# EasyEDA Pro project little_squeaky_machine_v2_2026-02-17.epro, board Little Squeaky Machine
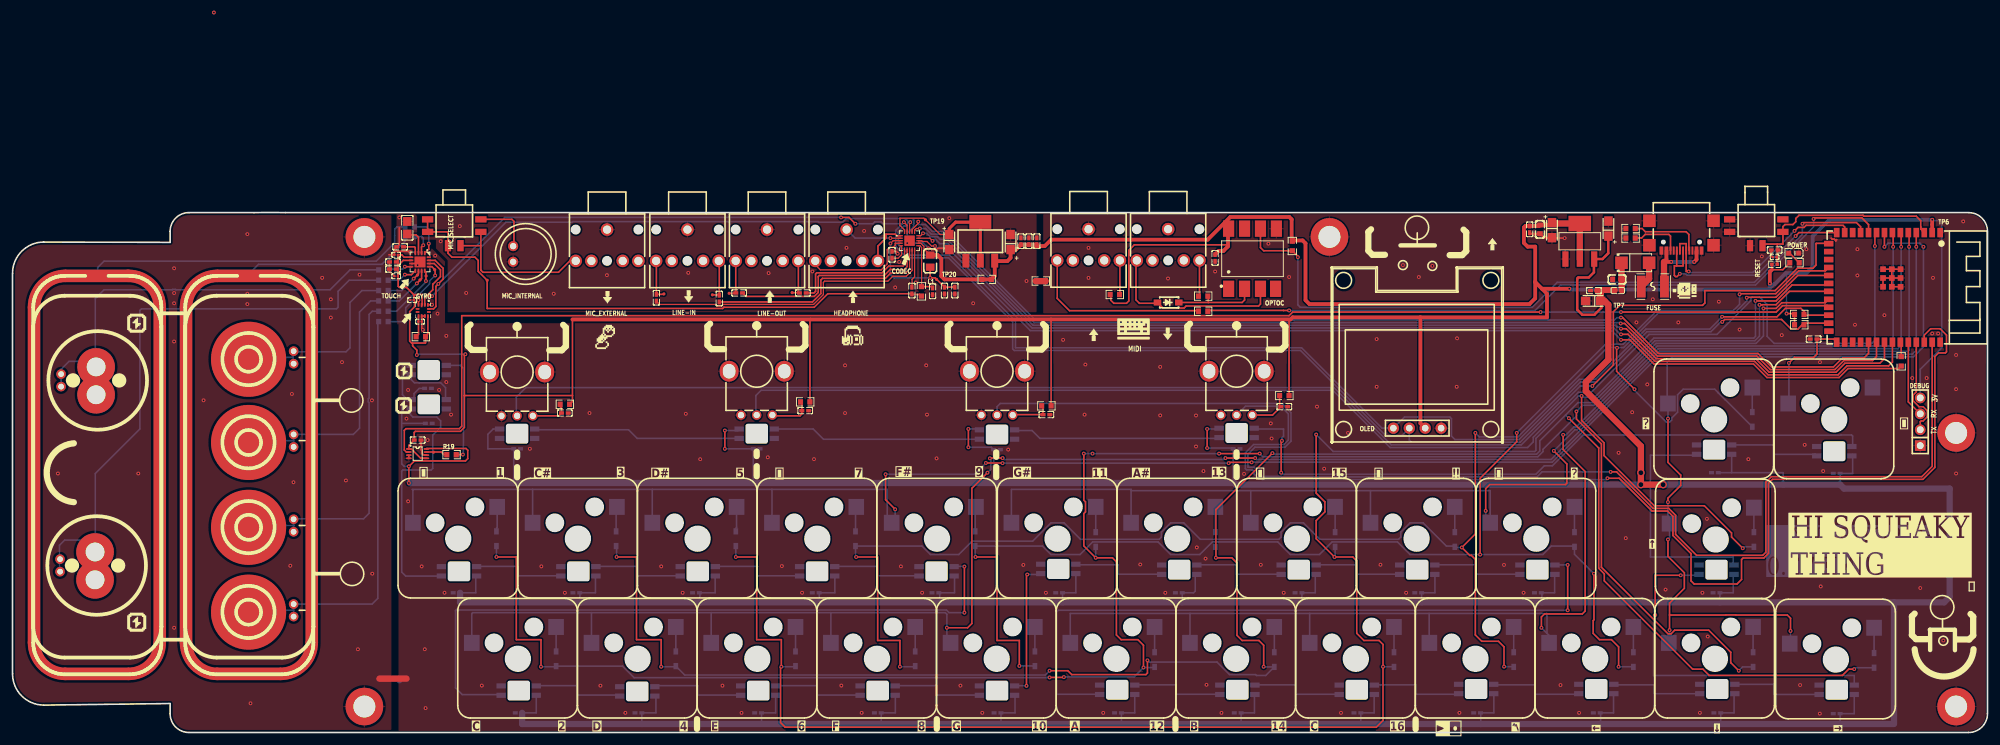
[diagram p8: board, top side]
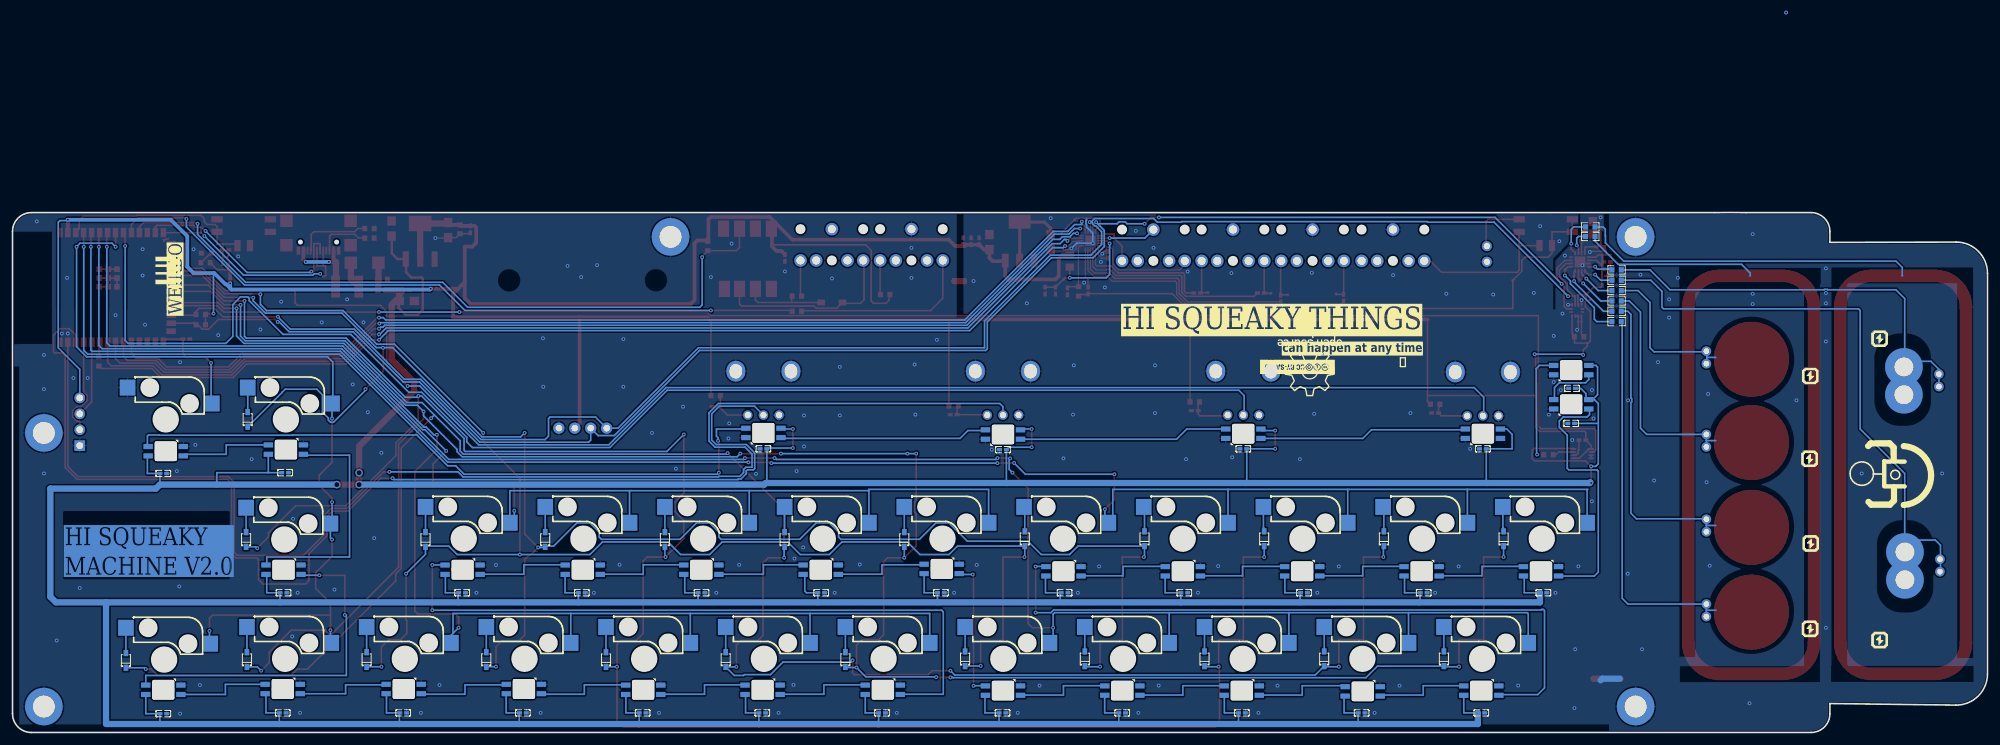
[diagram p9: board, bottom side, seen from below]

Outline 315.15 x 83.04 mm; copper layers: Top Layer, Bottom Layer. Coordinates in mm from the lower left corner of the outline.
Outline path: 0,73.32 arc(1.46,76.85) 5,78.32 25.15,78.26 25.15,80.02 arc(26.02,82.14) 28.15,83.02 38.53,83.02 arc(41.05,83.04) 43.57,83.02 312.15,83.02 arc(314.27,82.14) 315.15,80.02 315.15,3 arc(314.27,0.88) 312.15,0 28.15,0 arc(26.02,0.88) 25.15,3 25.15,4.62 5,4.37 arc(1.46,5.83) 0,9.37 0,73.32
Stack: Top Layer 0.035mm / Dielectric1 1.51mm FR4 er 4.5 / Bottom Layer 0.035mm

## Design rules (mm)
template: JLCPCB Capability(Two Layers Board)
spacing copperThickness1oz (default): track to track 0.102, other pairs 0.152 to 0.3
spacing copperThickness2oz: track to track 0.203, other pairs 0.152 to 0.3
track width copperThickness1oz (default): min 0.127, default 0.254, max 2.54
track width copperThickness2oz: min 0.203, default 0.254, max 2.54
differential pair differentialPair (default): width min 0.127, default 0.254, max 2.54; gap min 0.152, default 0.152
via viaSize (default): diameter min 0.5, default 0.61, max 10; hole min 0.3, default 0.305, max 6.3

## Placement (name value [footprint] x y rotation side)
3_3_BRIGDE  0  [R0603]  155.45 72.35 0 top
A_D_BRIDGE  0  [R0603]  164.08 72.09 0 top
C7  10uF  [C0603]  243.74 80.35 270 top
C8  100nF  [C0402]  242.09 80.35 90 top
C9  1uF  [C0201]  281.18 75.9 180 top
C10  100nF  [C0402]  287.4 62.82 0 top
C11  100nF  [C0402]  281.18 77.05 0 top
C12  10uF  [CASE-A_3216]  254.66 80.47 90 top
C13  22uF  [CASE-A_3216]  245.65 80.22 270 top
C14  10uF  [CASE-A_3216]  159.26 78.32 90 top
C15  22uF  [CASE-A_3216]  149.48 78.32 270 top
C16  100nF  [C0402]  64.64 46.69 180 top
C17  100nF  [C0402]  150.37 70.57 90 top
C18  2.2uF  [C0402]  148.72 70.57 90 top
C19  2.2uF  [C0402]  163.45 78.44 270 top
C20  100nF  [C0402]  160.91 78.45 270 top
C21  100nF  [C0402]  162.18 78.45 270 top
C22  150nF  [C0402]  140.34 76.29 270 top
C25  2.2uF  [C0402]  102.74 69.43 270 top
C26  2.2uF  [C0402]  112.78 69.3 270 top
C27  2.2uF  [C0402]  115.95 70.19 0 top
C28  2.2uF  [C0402]  126.11 70.19 0 top
C29  100nF  [C0402]  143.51 70.57 90 top
C30  2.2uF  [C0402]  146.81 70.45 90 top
C31  22uF  [C0402]  202.95 52.03 180 top
C32  22uF  [C0402]  164.97 50.76 180 top
C33  22uF  [C0402]  126.49 51.4 180 top
C34  22uF  [C0402]  88.14 51.01 180 top
C35  1uF  [C0201]  65.02 65.62 0 top
C36  1uF  [C0201]  63.75 69.05 180 top
C37  1uF  [C0201]  61.21 72.86 180 top
C38  100nF  [C0402]  60.71 74 0 top
C39  100nF  [C0402]  60.71 75.14 0 top
C40  1uF  [C0201]  61.21 76.28 180 top
C41  100nF  [C0402]  61.85 77.55 180 top
C43  2.2nF  [C0805]  62.99 80.6 90 top
C44  10uF  [CASE-A_3216]  252.22 68.92 180 top
C45  100nF  [C0402]  252.35 70.57 0 top
C46  10nF  [C0603]  256.03 72.35 0 top
CLED1  100nF  [C0402]  70.87 22.31 0 bottom
CLED2  100nF  [C0402]  89.97 22.31 0 bottom
CLED3  100nF  [C0402]  109.07 22.31 0 bottom
CLED4  100nF  [C0402]  128.17 22.31 0 bottom
CLED5  100nF  [C0402]  147.27 22.31 0 bottom
CLED6  100nF  [C0402]  80.77 3.13 0 bottom
CLED7  100nF  [C0402]  99.87 3.13 0 bottom
CLED8  100nF  [C0402]  118.97 3.13 0 bottom
CLED9  100nF  [C0402]  138.07 3.13 0 bottom
CLED10  100nF  [C0402]  157.17 3.13 0 bottom
CLED11  100nF  [C0402]  167 22.31 0 bottom
CLED12  100nF  [C0402]  186.1 22.31 0 bottom
CLED13  100nF  [C0402]  205.21 22.31 0 bottom
CLED14  100nF  [C0402]  224.31 22.31 0 bottom
CLED15  100nF  [C0402]  243.41 22.31 0 bottom
CLED16  100nF  [C0402]  176.4 3.13 0 bottom
CLED17  100nF  [C0402]  195.5 3.13 0 bottom
CLED18  100nF  [C0402]  214.6 3.13 0 bottom
CLED19  100nF  [C0402]  233.7 3.13 0 bottom
CLED20  100nF  [C0402]  252.8 3.13 0 bottom
CLED21  100nF  [C0402]  272.03 3.13 0 bottom
CLED22  100nF  [C0402]  291.08 3.01 0 bottom
CLED23  100nF  [C0402]  271.91 22.31 0 bottom
CLED24  100nF  [C0402]  271.65 41.49 0 bottom
CLED25  100nF  [C0402]  291.08 41.36 0 bottom
CLED26  100nF  [C0402]  195.33 45.3 180 bottom
CLED27  100nF  [C0402]  157.1 45.17 180 bottom
CLED28  100nF  [C0402]  118.75 45.3 180 bottom
CLED29  100nF  [C0402]  80.52 45.3 180 bottom
CLED30  100nF  [C0402]  66.42 49.36 180 bottom
CLED31  100nF  [C0402]  66.29 54.95 180 bottom
CMIDI  100nF  [C0402]  191.9 75.78 90 top
CODEC  SGTL5000XNLA3R2  [QFN-20_L3.0-W3.0-P0.40-BL-EP1.7]  143.14 78.53 270 top
D1  SS34  [SMA_L4.3-W2.6-LS5.2-RD]  258.95 75.01 0 top
D2  1N914W  [SOD-123_L2.7-W1.6-LS3.7-RD-1]  184.4 68.67 180 top
DEBUG  B-2100S04P-C000  [HDR-TH_4P-P2.54-V-M]  304.42 49.61 90 top
ESP32S3  ESP32-S3-WROOM-1-N16R8  [WIRELM-SMD_ESP32-S3-WROOM-1]  298.7 71.08 270 top
FUSE  SMD1812-300C-16V  [F1812]  261.75 71.2 180 top
GYRO  STK8321  [LGA-12_L2.0-W2.0-P0.50-TR]  65.53 67.39 0 top
HEADPHONE  PJ-3062-HD-B  [AUDIO-TH_PJ-3062-HD-B]  133.1 77.81 270 top
KEY_1  CPG151101S11-16  [SMD_KEYBOARD-SW]  70.61 34.76 0 bottom
KEY_2  CPG151101S11-16  [SMD_KEYBOARD-SW]  89.71 34.76 0 bottom
KEY_3  CPG151101S11-16  [SMD_KEYBOARD-SW]  108.81 34.76 0 bottom
KEY_4  CPG151101S11-16  [SMD_KEYBOARD-SW]  127.91 34.76 0 bottom
KEY_5  CPG151101S11-16  [SMD_KEYBOARD-SW]  147.01 34.76 0 bottom
KEY_6  CPG151101S11-16  [SMD_KEYBOARD-SW]  80.01 15.58 0 bottom
KEY_7  CPG151101S11-16  [SMD_KEYBOARD-SW]  99.11 15.58 0 bottom
KEY_8  CPG151101S11-16  [SMD_KEYBOARD-SW]  118.21 15.58 0 bottom
KEY_9  CPG151101S11-16  [SMD_KEYBOARD-SW]  137.31 15.58 0 bottom
KEY_10  CPG151101S11-16  [SMD_KEYBOARD-SW]  156.41 15.58 0 bottom
KEY_11  CPG151101S11-16  [SMD_KEYBOARD-SW]  166.12 34.76 0 bottom
KEY_12  CPG151101S11-16  [SMD_KEYBOARD-SW]  185.22 34.76 0 bottom
KEY_13  CPG151101S11-16  [SMD_KEYBOARD-SW]  204.32 34.76 0 bottom
KEY_14  CPG151101S11-16  [SMD_KEYBOARD-SW]  223.42 34.76 0 bottom
KEY_15  CPG151101S11-16  [SMD_KEYBOARD-SW]  242.52 34.76 0 bottom
KEY_16  CPG151101S11-16  [SMD_KEYBOARD-SW]  175.51 15.58 0 bottom
KEY_17  CPG151101S11-16  [SMD_KEYBOARD-SW]  194.61 15.58 0 bottom
KEY_18  CPG151101S11-16  [SMD_KEYBOARD-SW]  213.71 15.58 0 bottom
KEY_19  CPG151101S11-16  [SMD_KEYBOARD-SW]  232.81 15.58 0 bottom
KEY_20  CPG151101S11-16  [SMD_KEYBOARD-SW]  251.91 15.58 0 bottom
KEY_21  CPG151101S11-16  [SMD_KEYBOARD-SW]  271.02 15.58 0 bottom
KEY_22  CPG151101S11-16  [SMD_KEYBOARD-SW]  290.32 15.45 0 bottom
KEY_23  CPG151101S11-16  [SMD_KEYBOARD-SW]  271.14 34.63 0 bottom
KEY_24  CPG151101S11-16  [SMD_KEYBOARD-SW]  270.89 53.81 0 bottom
KEY_25  CPG151101S11-16  [SMD_KEYBOARD-SW]  290.07 53.81 0 bottom
KEY_D1  -  [SOD-323_L1.8-W1.3-LS2.5-RD]  77.22 30.95 90 bottom
KEY_D2  -  [SOD-323_L1.8-W1.3-LS2.5-RD]  96.32 30.95 90 bottom
KEY_D3  -  [SOD-323_L1.8-W1.3-LS2.5-RD]  115.42 30.95 90 bottom
KEY_D4  -  [SOD-323_L1.8-W1.3-LS2.5-RD]  134.52 30.95 90 bottom
KEY_D5  -  [SOD-323_L1.8-W1.3-LS2.5-RD]  153.62 30.95 90 bottom
KEY_D6  -  [SOD-323_L1.8-W1.3-LS2.5-RD]  86.74 11.77 90 bottom
KEY_D7  -  [SOD-323_L1.8-W1.3-LS2.5-RD]  105.84 11.77 90 bottom
KEY_D8  -  [SOD-323_L1.8-W1.3-LS2.5-RD]  124.94 11.77 90 bottom
KEY_D9  -  [SOD-323_L1.8-W1.3-LS2.5-RD]  144.04 11.77 90 bottom
KEY_D10  -  [SOD-323_L1.8-W1.3-LS2.5-RD]  163.14 11.77 90 bottom
KEY_D11  -  [SOD-323_L1.8-W1.3-LS2.5-RD]  172.85 30.82 90 bottom
KEY_D12  -  [SOD-323_L1.8-W1.3-LS2.5-RD]  191.95 30.82 90 bottom
KEY_D13  -  [SOD-323_L1.8-W1.3-LS2.5-RD]  211.05 30.82 90 bottom
KEY_D14  -  [SOD-323_L1.8-W1.3-LS2.5-RD]  230.15 30.82 90 bottom
KEY_D15  -  [SOD-323_L1.8-W1.3-LS2.5-RD]  249.25 30.82 90 bottom
KEY_D16  -  [SOD-323_L1.8-W1.3-LS2.5-RD]  182.25 11.64 90 bottom
KEY_D17  -  [SOD-323_L1.8-W1.3-LS2.5-RD]  201.34 11.64 90 bottom
KEY_D18  -  [SOD-323_L1.8-W1.3-LS2.5-RD]  220.44 11.64 90 bottom
KEY_D19  -  [SOD-323_L1.8-W1.3-LS2.5-RD]  239.55 11.64 90 bottom
KEY_D20  -  [SOD-323_L1.8-W1.3-LS2.5-RD]  258.64 11.64 90 bottom
KEY_D21  -  [SOD-323_L1.8-W1.3-LS2.5-RD]  277.75 11.64 90 bottom
KEY_D22  -  [SOD-323_L1.8-W1.3-LS2.5-RD]  297.05 11.51 90 bottom
KEY_D23  -  [SOD-323_L1.8-W1.3-LS2.5-RD]  277.88 30.82 90 bottom
KEY_D24  -  [SOD-323_L1.8-W1.3-LS2.5-RD]  277.62 50 90 bottom
KEY_SW_1  CPG1511F01S04  [KEY-TH_CPG1511F01S0X]  70.48 34.76 0 top
KEY_SW_2  CPG1511F01S04  [KEY-TH_CPG1511F01S0X]  89.59 34.76 0 top
KEY_SW_3  CPG1511F01S04  [KEY-TH_CPG1511F01S0X]  108.69 34.76 0 top
KEY_SW_4  CPG1511F01S04  [KEY-TH_CPG1511F01S0X]  127.78 34.76 0 top
KEY_SW_5  CPG1511F01S04  [KEY-TH_CPG1511F01S0X]  146.88 34.76 0 top
KEY_SW_6  CPG1511F01S04  [KEY-TH_CPG1511F01S0X]  80.01 15.58 0 top
KEY_SW_7  CPG1511F01S04  [KEY-TH_CPG1511F01S0X]  99.11 15.58 0 top
KEY_SW_8  CPG1511F01S04  [KEY-TH_CPG1511F01S0X]  118.21 15.58 0 top
KEY_SW_9  CPG1511F01S04  [KEY-TH_CPG1511F01S0X]  137.31 15.58 0 top
KEY_SW_10  CPG1511F01S04  [KEY-TH_CPG1511F01S0X]  156.41 15.58 0 top
KEY_SW_11  CPG1511F01S04  [KEY-TH_CPG1511F01S0X]  166.12 34.76 0 top
KEY_SW_12  CPG1511F01S04  [KEY-TH_CPG1511F01S0X]  185.22 34.76 0 top
KEY_SW_13  CPG1511F01S04  [KEY-TH_CPG1511F01S0X]  204.32 34.76 0 top
KEY_SW_14  CPG1511F01S04  [KEY-TH_CPG1511F01S0X]  223.42 34.76 0 top
KEY_SW_15  CPG1511F01S04  [KEY-TH_CPG1511F01S0X]  242.52 34.76 0 top
KEY_SW_16  CPG1511F01S04  [KEY-TH_CPG1511F01S0X]  175.51 15.58 0 top
KEY_SW_17  CPG1511F01S04  [KEY-TH_CPG1511F01S0X]  194.61 15.58 0 top
KEY_SW_18  CPG1511F01S04  [KEY-TH_CPG1511F01S0X]  213.71 15.58 0 top
KEY_SW_19  CPG1511F01S04  [KEY-TH_CPG1511F01S0X]  232.81 15.58 0 top
KEY_SW_20  CPG1511F01S04  [KEY-TH_CPG1511F01S0X]  251.91 15.58 0 top
KEY_SW_21  CPG1511F01S04  [KEY-TH_CPG1511F01S0X]  271.02 15.58 0 top
KEY_SW_22  CPG1511F01S04  [KEY-TH_CPG1511F01S0X]  290.32 15.45 0 top
KEY_SW_23  CPG1511F01S04  [KEY-TH_CPG1511F01S0X]  271.14 34.63 0 top
KEY_SW_24  CPG1511F01S04  [KEY-TH_CPG1511F01S0X]  270.89 53.81 0 top
KEY_SW_25  CPG1511F01S04  [KEY-TH_CPG1511F01S0X]  290.07 53.81 0 top
L1  HCB2012KV-601T20  [L0805]  146.43 75.27 270 top
L2  BLM15PX330SN1D  [L0402]  256.16 70.57 180 top
LDO  AMS1117-3.3  [SOT-223-4_L6.5-W3.5-P2.30-LS7.0-BR]  250.09 78.44 270 top
LED1  SK6812MINI-E  [LED-SMD_L3.2-W2.8-LS5.9_SK6812MINI-E]  71.25 25.74 0 bottom
LED2  SK6812MINI-E  [LED-SMD_L3.2-W2.8-LS5.9_SK6812MINI-E]  90.3 25.74 0 bottom
LED3  SK6812MINI-E  [LED-SMD_L3.2-W2.8-LS5.9_SK6812MINI-E]  109.35 25.74 0 bottom
LED4  SK6812MINI-E  [LED-SMD_L3.2-W2.8-LS5.9_SK6812MINI-E]  128.4 25.74 0 bottom
LED5  SK6812MINI-E  [LED-SMD_L3.2-W2.8-LS5.9_SK6812MINI-E]  147.45 25.74 0 bottom
LED6  SK6812MINI-E  [LED-SMD_L3.2-W2.8-LS5.9_SK6812MINI-E]  80.77 6.69 0 bottom
LED7  SK6812MINI-E  [LED-SMD_L3.2-W2.8-LS5.9_SK6812MINI-E]  99.7 6.56 0 bottom
LED8  SK6812MINI-E  [LED-SMD_L3.2-W2.8-LS5.9_SK6812MINI-E]  119 6.69 0 bottom
LED9  SK6812MINI-E  [LED-SMD_L3.2-W2.8-LS5.9_SK6812MINI-E]  138.05 6.69 0 bottom
LED10  SK6812MINI-E  [LED-SMD_L3.2-W2.8-LS5.9_SK6812MINI-E]  157.1 6.69 0 bottom
LED11  SK6812MINI-E  [LED-SMD_L3.2-W2.8-LS5.9_SK6812MINI-E]  166.88 26.12 0 bottom
LED12  SK6812MINI-E  [LED-SMD_L3.2-W2.8-LS5.9_SK6812MINI-E]  186.18 25.99 0 bottom
LED13  SK6812MINI-E  [LED-SMD_L3.2-W2.8-LS5.9_SK6812MINI-E]  205.23 25.99 0 bottom
LED14  SK6812MINI-E  [LED-SMD_L3.2-W2.8-LS5.9_SK6812MINI-E]  224.16 25.99 0 bottom
LED15  SK6812MINI-E  [LED-SMD_L3.2-W2.8-LS5.9_SK6812MINI-E]  243.33 25.99 0 bottom
LED16  SK6812MINI-E  [LED-SMD_L3.2-W2.8-LS5.9_SK6812MINI-E]  176.28 6.82 0 bottom
LED17  SK6812MINI-E  [LED-SMD_L3.2-W2.8-LS5.9_SK6812MINI-E]  195.45 6.82 0 bottom
LED18  SK6812MINI-E  [LED-SMD_L3.2-W2.8-LS5.9_SK6812MINI-E]  214.5 6.82 0 bottom
LED19  SK6812MINI-E  [LED-SMD_L3.2-W2.8-LS5.9_SK6812MINI-E]  233.55 6.94 0 bottom
LED20  SK6812MINI-E  [LED-SMD_L3.2-W2.8-LS5.9_SK6812MINI-E]  252.73 6.94 0 bottom
LED21  SK6812MINI-E  [LED-SMD_L3.2-W2.8-LS5.9_SK6812MINI-E]  272.03 6.94 0 bottom
LED22  SK6812MINI-E  [LED-SMD_L3.2-W2.8-LS5.9_SK6812MINI-E]  291.08 6.82 0 bottom
LED23  SK6812MINI-E  [LED-SMD_L3.2-W2.8-LS5.9_SK6812MINI-E]  271.91 25.99 0 bottom
LED24  SK6812MINI-E  [LED-SMD_L3.2-W2.8-LS5.9_SK6812MINI-E]  271.53 45.17 0 bottom
LED25  SK6812MINI-E  [LED-SMD_L3.2-W2.8-LS5.9_SK6812MINI-E]  290.7 44.92 0 bottom
LED26  SK6812MINI-E  [LED-SMD_L3.2-W2.8-LS5.9_SK6812MINI-E]  195.33 47.84 180 bottom
LED27  SK6812MINI-E  [LED-SMD_L3.2-W2.8-LS5.9_SK6812MINI-E]  157.1 47.58 180 bottom
LED28  SK6812MINI-E  [LED-SMD_L3.2-W2.8-LS5.9_SK6812MINI-E]  118.75 47.71 180 bottom
LED29  SK6812MINI-E  [LED-SMD_L3.2-W2.8-LS5.9_SK6812MINI-E]  80.52 47.71 180 bottom
LED30  SK6812MINI-E  [LED-SMD_L3.2-W2.8-LS5.9_SK6812MINI-E]  66.42 57.87 180 bottom
LED31  SK6812MINI-E  [LED-SMD_L3.2-W2.8-LS5.9_SK6812MINI-E]  66.42 52.41 180 bottom
LINE-IN  PJ-3062-HD-B  [AUDIO-TH_PJ-3062-HD-B]  107.7 77.81 270 top
LINE-OUT  PJ-3062-HD-B  [AUDIO-TH_PJ-3062-HD-B]  120.4 77.81 270 top
MIC_EXTERNAL  PJ-3062-HD-B  [AUDIO-TH_PJ-3062-HD-B]  94.87 77.81 270 top
MIC_INTERNAL  KEAG4544PF-K  [MIC-TH_BD9.7-P2.50-D0.8-L-FD]  79.88 76.41 270 top
MIC_SELECT  XKB5858-Z-F-75  [SW-SMD_XKB5858-Z-F-75]  70.48 79.84 0 top
MIDI-IN  PJ-3062-HD-B  [AUDIO-TH_PJ-3062-HD-B]  184.4 77.88 270 top
MIDI-OUT  PJ-3062-HD-B  [AUDIO-TH_PJ-3062-HD-B]  171.7 77.88 270 top
NOREF  -  [Pad_e110]  310.15 47.84 0 top
NOREF#2  -  [Pad_e1855]  56.15 4.14 0 top
NOREF#3  -  [Pad_e3607]  210.15 79.14 0 top
NOREF#4  -  [Pad_e1861]  310.15 4.14 0 top
NOREF#5  -  [Pad_e3629]  56.15 79.14 0 top
OLED  HS96L03W2C03  [OLED-TH_L27.8-W27.2-P2.54_C9900033791]  224.16 48.6 180 top
OPTOC  6N137S1(TA)  [SMD-8_L9.8-W6.6-P2.54-LS10.3-BL]  197.87 75.65 0 top
POT_1  10kΩ  [RES-ADJ-TH_RK09K1130A5R]  80.52 54.06 0 top
POT_2  10kΩ  [RES-ADJ-TH_RK09K1130A5R]  118.75 54.19 0 top
POT_3  10kΩ  [RES-ADJ-TH_RK09K1130A5R]  157.1 54.19 0 top
POT_4  10kΩ  [RES-ADJ-TH_RK09K1130A5R]  195.33 54.19 0 top
POWER  F.0603.00025/P2-0603G1TS2-06T-002  [LED0603-RD_GREEN]  284.23 76.54 180 top
R1  5.1kΩ  [R0603]  258.19 78.95 0 top
R2  5.1kΩ  [R0603]  258.19 80.48 0 top
R3  10kΩ  [R0402]  281.18 74.76 0 top
R4  1kΩ  [R0603]  284.35 75.01 0 top
R5  2.2kΩ  [R0603]  285.11 65.11 0 top
R6  2.2kΩ  [R0603]  285.11 66.76 0 top
R7  100Ω  [R0603]  301.37 59.27 270 top
R8  2.2kΩ  [R0603]  145.03 70.45 90 top
R9  220Ω  [R0603]  189.99 69.68 0 top
R10  470Ω  [R0603]  204.22 77.68 90 top
R12  33Ω  [R0603]  175.9 69.93 180 top
R13  10Ω  [R0603]  189.99 67.27 0 top
R14  100Ω  [R0603]  202.95 53.81 0 top
R15  100Ω  [R0603]  164.97 52.16 0 top
R16  100Ω  [R0603]  126.49 52.79 0 top
R17  100Ω  [R0603]  88.14 52.41 0 top
R18  22Ω  [R0603]  65.15 63.2 0 top
R19  500Ω  [R0603]  70.05 44.36 0 top
R20  500Ω  [R0603]  59.18 70.57 180 bottom
R21  500Ω  [R0603]  59.18 67.27 180 bottom
R22  500Ω  [R0603]  59.18 65.62 180 bottom
R23  500Ω  [R0603]  59.18 68.92 180 bottom
R24  500Ω  [R0603]  59.18 73.87 0 bottom
R25  500Ω  [R0603]  59.18 72.22 0 bottom
R26  500Ω  [R0603]  63.37 80.73 0 bottom
R27  500Ω  [R0603]  63.37 79.21 0 bottom
RESET  XKB5858-W-F-75  [SW-SMD_XKB5858-W-F-75]  278.26 79.84 0 top
TOUCH  CY8CMBR3108-LQXI  [QFN-16_L3.0-W3.0-P0.50-BL-EP1.7]  65.02 75.14 180 top
TP2  -  [matrix_touchpad]  37.46 33.06 0 top
TP3  -  [matrix_touchpad]  37.47 19.52 0 top
TP4  -  [matrix_touchpad]  37.47 59.9 0 top
TP5  -  [matrix_touchpad]  37.46 46.61 0 top
TP6  -  [Test-Point-0.5mm]  306.32 81.11 0 top
TP7  -  [Test-Point-0.5mm]  254.63 67.52 0 top
TP14  -  [Test-Point-0.5mm]  75.74 72.21 0 top
TP15  -  [Test-Point-0.5mm]  103.94 70.03 0 top
TP16  -  [Test-Point-0.5mm]  111.69 69.89 0 top
TP17  -  [Test-Point-0.5mm]  114.35 70.13 0 top
TP18  -  [Test-Point-0.5mm]  124.4 70.24 0 top
TP19  -  [Test-Point-0.5mm]  145.67 81.87 0 top
TP20  -  [Test-Point-0.5mm]  147.45 72.35 0 top
TP21  -  [Test-Point-0.5mm]  67.17 44.77 0 top
TP22  -  [Test-Point-0.5mm]  64.61 73.05 0 top
TP23  -  [Test-Point-0.5mm]  65.99 72.91 0 top
TP24  -  [Test-Point-0.5mm]  67.37 73.89 0 top
TP25  -  [Test-Point-0.5mm]  65.01 72.25 0 top
TPA1  -  [touchpad_external]  13.46 55.58 0 top
TPA2  -  [touchpad_external]  13.3 26.03 0 top
U1  AMS1117-1.8  [SOT-223_L6.7-W3.5-P2.30-BR]  154.43 78.45 270 top
U2  GT74LVC2T45V8  [VSSOP-8_L2.3-W2.0-P0.50-LS3.1-BL]  64.64 44.53 270 top
U5  -  [proximity_sensor]  2.29 73.87 0 top
U6  -  [proximity_sensor]  26.54 73.87 0 top
USB  TYPEC-304YSSW-ACP16  [USB-SMD_TYPEC-304YSSW-ACP16]  266.32 79.33 180 top

## Footprints (pads in the part's own frame, mm; a bottom-side part is the same pattern mirrored in y, then rotated)
AUDIO-TH_PJ-3062-HD-B
  round 2 hole 1.3: 1(-2.5,0) 2(2.5,5) 3(2.5,2.499) 4(2.5,-2.5) 5(2.5,-5)
C0201
  rect 0.368x0.324 smd: 1(-0.275,0) 2(0.275,0)
C0402
  rect 0.79x0.54 smd: 1(-0.545,0) 2(0.545,0)
C0603
  rect 0.8x0.9 smd: 1(-0.7,0) 2(0.7,0)
C0805
  rect 1.41x1.35 smd: 1(-1,0) 2(1,0)
CASE-A_3216
  rect 1.5x1.359 smd: 1(-1.2,0) 2(1.2,0)
F1812
  rect 1.407x3.499 smd: 1(-1.853,0) 2(1.853,0)
HDR-TH_4P-P2.54-V-M
  rect 1.7x1.7 hole 1.1: 1(-3.81,0)
  round 1.7 hole 1.1: 2(-1.27,0) 3(1.27,0) 4(3.81,0)
L0402
  rect 0.54x0.54 smd: 1(-0.42,0) 2(0.42,0)
L0805
  rect 1.133x1.377 smd: 1(-0.966,0) 2(0.966,0)
LED0603-RD_GREEN
  rect 0.8x0.8 smd: 1(-0.799,-0.004) 2(0.799,0.004)
LED-SMD_L3.2-W2.8-LS5.9_SK6812MINI-E
  rect 1.5x0.82 smd: 1(2.8,0.75) 2(2.8,-0.75) 3(-2.8,-0.75) 4(-2.8,0.75)
LGA-12_L2.0-W2.0-P0.50-TR
  rect 0.28x0.58 smd: 1(0.75,0.9) 2(0.25,0.9) 4(-0.75,0.9) 7(-0.75,-0.9) 8(-0.25,-0.9) 9(0.25,-0.9) 10(0.75,-0.9)
  rect 0.28x0.67 smd: 3(-0.25,0.855)
  rect 0.58x0.28 smd: 5(-0.9,0.25) 6(-0.9,-0.25) 11(0.9,-0.25) 12(0.9,0.25)
matrix_touchpad
  round 1.524 hole 0.914: 1(7.389,0.989) 1(7.389,-1.011)
MIC-TH_BD9.7-P2.50-D0.8-L-FD
  round 1.6 hole 1: 1(-1.25,0) 2(1.25,0)
OLED-TH_L27.8-W27.2-P2.54_C9900033791
  round 1.8 hole 1.05: 1(-3.81,0) 2(-1.27,0) 3(1.27,0) 4(3.81,0)
Pad_e110
  round 6 hole 3.5: (0,0)
Pad_e1855
  round 6 hole 3.5: (0,0)
Pad_e1861
  round 6 hole 3.5: (0,0)
Pad_e3607
  round 6 hole 3.5: (0,0)
Pad_e3629
  round 6 hole 3.5: (0,0)
QFN-16_L3.0-W3.0-P0.50-BL-EP1.7
  rect 0.28x0.665 smd: 1(-0.75,-1.407) 2(-0.25,-1.407) 3(0.25,-1.407) 4(0.75,-1.407) 9(0.75,1.407) 10(0.25,1.407) 11(-0.25,1.407) 12(-0.75,1.407)
  rect 0.665x0.28 smd: 5(1.407,-0.75) 6(1.407,-0.25) 7(1.407,0.25) 8(1.407,0.75) 13(-1.407,0.75) 14(-1.407,0.25) 15(-1.407,-0.25) 16(-1.407,-0.75)
  rect 1.75x1.75 smd: 17(0,0)
QFN-20_L3.0-W3.0-P0.40-BL-EP1.7
  rect 0.2x0.665 smd: 1(-0.8,-1.407) 2(-0.4,-1.407) 3(0,-1.407) 4(0.4,-1.407) 5(0.8,-1.407) 11(0.8,1.407) 12(0.4,1.407) 13(0,1.407) 14(-0.4,1.407) 15(-0.8,1.407)
  rect 0.665x0.2 smd: 6(1.407,-0.8) 7(1.407,-0.4) 8(1.407,0) 9(1.407,0.4) 10(1.407,0.8) 16(-1.407,0.8) 17(-1.407,0.4) 18(-1.407,0) 19(-1.407,-0.4) 20(-1.407,-0.8)
  rect 1.65x1.65 smd: 21(0,0)
R0402
  rect 0.566x0.54 smd: 1(-0.433,0) 2(0.433,0)
R0603
  rect 0.806x0.864 smd: 1(-0.753,0) 2(0.753,0)
RES-ADJ-TH_RK09K1130A5R
  round 1.5 hole 1: 1(-2.5,-3.5) 2(0,-3.5) 3(2.5,-3.5)
  oval 3x3.3 hole 2x2.3: 4(4.4,3.5) 5(-4.4,3.5)
SMA_L4.3-W2.6-LS5.2-RD
  rect 2x2 smd: 1(-2.2,0) 2(2.2,0)
SMD-8_L9.8-W6.6-P2.54-LS10.3-BL
  rect 1.78x2.6 smd: 1(-3.81,-4.8) 2(-1.27,-4.8) 3(1.27,-4.8) 4(3.683,-4.8) 5(3.81,4.8) 6(1.27,4.8) 7(-1.27,4.8) 8(-3.81,4.8)
SMD_KEYBOARD-SW
  rect 2.5x2.55 smd: 1(-6.725,1.27) 2(6.725,-1.27)
SOD-123_L2.7-W1.6-LS3.7-RD-1
  rect 1.2x0.95 smd: 1(-1.7,0) 2(1.7,0)
SOD-323_L1.8-W1.3-LS2.5-RD
  rect 1x0.75 smd: 1(-1.173,0) 2(1.173,0)
SOT-223-4_L6.5-W3.5-P2.30-LS7.0-BR
  rect 2.47x0.98 smd: 1(2.835,-2.3) 2(2.835,0) 3(2.835,2.3)
  rect 2.47x3.6 smd: 4(-2.835,0)
SOT-223_L6.7-W3.5-P2.30-BR
  rect 2.2x1.1 smd: 1(3.099,-2.3) 2(3.099,0) 3(3.099,2.3)
  rect 2.2x3.5 smd: 4(-3.099,0)
SW-SMD_XKB5858-W-F-75
  rect 1.8x1 smd: 1(-4.25,2.1) 2(-4.25,0.1) 3(4.25,2.1) 4(4.25,0.1)
  rect 1x1.8 smd: 5(-1,-2.1) 6(1,-2.1)
SW-SMD_XKB5858-Z-F-75
  rect 1.8x1 smd: 1(-4.25,2.1) 2(-4.25,0.1) 3(4.25,2.1) 4(4.25,0.1)
  rect 1x1.8 smd: 5(-1,-2.1) 6(1,-2.1)
Test-Point-0.5mm
  round 0.5 smd: 1(0,0)
touchpad_external
  round 1.524 hole 0.914: 1(-5.715,1.651) 1(-5.715,-0.349)
  round 6 hole 3: 1(-0.127,2.794) 1(-0.127,-1.651)
USB-SMD_TYPEC-304YSSW-ACP16
  rect 2x2 smd: 13(-5.12,1.52) 14(5.12,1.52) 15(-5.12,-2.38) 16(5.12,-2.38)
  rect 0.6x1.3 smd: A1B12(-3.2,2.38) A4B9(-2.4,2.38) B1A12(3.2,2.38) B4A9(2.4,2.38)
  rect 0.3x1.3 smd: A5(-1.25,2.38) A6(-0.25,2.38) A7(0.25,2.38) A8(1.25,2.38) B5(1.75,2.38) B6(0.75,2.38) B7(-0.75,2.38) B8(-1.75,2.38)
VSSOP-8_L2.3-W2.0-P0.50-LS3.1-BL
  oval 0.28x0.905 smd: 1(-0.75,-1.403) 2(-0.25,-1.403) 3(0.25,-1.403) 4(0.75,-1.403) 5(0.75,1.403) 6(0.25,1.403) 7(-0.25,1.403) 8(-0.75,1.403)
WIRELM-SMD_ESP32-S3-WROOM-1
  rect 1.5x0.9 smd: 1(-8.75,8.895) 2(-8.75,7.625) 3(-8.75,6.355) 4(-8.75,5.085) 5(-8.75,3.815) 6(-8.75,2.545) 7(-8.75,1.275) 8(-8.75,0.005) 9(-8.75,-1.265) 10(-8.75,-2.535) 11(-8.75,-3.805) 12(-8.75,-5.075) 13(-8.75,-6.345) 14(-8.75,-7.615) 27(8.75,-7.615) 28(8.75,-6.345) 29(8.75,-5.075) 30(8.75,-3.805) 31(8.75,-2.535) 32(8.75,-1.265) 33(8.75,0.005) 34(8.75,1.275) 35(8.75,2.545) 36(8.75,3.815) 37(8.75,5.085) 38(8.75,6.355) 39(8.75,7.625) 40(8.75,8.895)
  rect 0.9x1.5 smd: 15(-6.985,-8.895) 16(-5.715,-8.895) 17(-4.445,-8.895) 18(-3.175,-8.895) 19(-1.905,-8.895) 20(-0.635,-8.895) 21(0.635,-8.895) 22(1.905,-8.895) 23(3.175,-8.895) 24(4.445,-8.895) 25(5.715,-8.895) 26(6.985,-8.865)
  rect 0.9x0.9 smd: 41(-2.9,2.575) 41(-2.9,1.175) 41(-2.9,-0.225) 41(-1.5,2.575) 41(-1.5,1.175) 41(-1.5,-0.225) 41(-0.1,2.575) 41(-0.1,1.175) 41(-0.1,-0.225)

## Nets
As in the schematic, except:
AGND: A_D_BRIDGE.1 A_D_BRIDGE.2 C7.2 C8.1 C9.2 C10.1 C11.1 C12.2 C13.2 C14.2 C15.2 C16.1 C17.1 C18.1 C19.1 C20.1 C21.1 C22.1 C30.1 C31.1 C32.1 C33.1 C34.1 C35.2 C36.2 C37.2 C38.1 C39.1 C40.2 C41.2 C43.2 C44.2 C45.1 C46.1 CLED1.1 CLED2.1 CLED3.1 CLED4.1 CLED5.1 CLED6.1 CLED7.1 CLED8.1 CLED9.1 CLED10.1 CLED11.1 CLED12.1 CLED13.1 CLED14.1 CLED15.1 CLED16.1 CLED17.1 CLED18.1 CLED19.1 CLED20.1 CLED21.1 CLED22.1 CLED23.1 CLED24.1 CLED25.1 CLED26.1 CLED27.1 CLED28.1 CLED29.1 CLED30.1 CLED31.1 CMIDI.1 CODEC.21 DEBUG.1 ESP32S3.1 ESP32S3.40 ESP32S3.41 GYRO.1 GYRO.4 GYRO.8 GYRO.9 KEY_25.2 LDO.1 LED1.3 LED2.3 LED3.3 LED4.3 LED5.3 LED6.3 LED7.3 LED8.3 LED9.3 LED10.3 LED11.3 LED12.3 LED13.3 LED14.3 LED15.3 LED16.3 LED17.3 LED18.3 LED19.3 LED20.3 LED21.3 LED22.3 LED23.3 LED24.3 LED25.3 LED26.3 LED27.3 LED28.3 LED29.3 LED30.3 LED31.3 LINE-IN.1 LINE-OUT.1 MIC_EXTERNAL.1 MIC_INTERNAL.2 MIDI-OUT.1 NOREF. NOREF#2. NOREF#3. NOREF#4. NOREF#5. OLED.1 OPTOC.5 POT_1.1 POT_1.4 POT_1.5 POT_2.1 POT_2.4 POT_2.5 POT_3.1 POT_3.4 POT_3.5 POT_4.1 POT_4.4 POT_4.5 POWER.1 R1.1 R2.1 RESET.1 RESET.2 RESET.5 TOUCH.7 TOUCH.17 U1.1 U2.3 U2.4 U2.6 USB.13 USB.14 USB.15 USB.16 USB.A1B12 USB.B1A12

Pads without a net: ESP32S3 12 16 17 26 28 29 30; GYRO 5 6 11; HEADPHONE 3 4; LED29 2; LINE-IN 3 4; LINE-OUT 3 4; MIC_EXTERNAL 2 3 4; MIDI-IN 1 3 4; MIDI-OUT 3 4; OPTOC 1 4 7; RESET 3; TOUCH 16; USB A8 B8

## Via types
v1: diameter 0.61, hole 0.305, Top Layer to Bottom Layer, 324 vias
v2: diameter 1.2, hole 0.8, Top Layer to Bottom Layer, 3 vias

## Routing (per net, layer and track width the routed paths; a pad name or vN(x,y) marks a point on that pad's centre or on a via; arc(x,y) is an arc through that point)
+1.8V: length 24
  Top Layer w0.2: C15.1 148.02,79.52 TP19.1 145.42,82.13 141.6,82.13 141.6,80.98 142.34,80.25 CODEC.20
  Top Layer w0.5: C15.1 149.48,80.48 150.5,81.49 154.38,81.49 U1.4 U1.2
+3.3V: length 622.5
  Top Layer w0.2: 146.35,76.33 145.43,77.25 145.43,77.64 144.94,78.13 144.55,78.13 CODEC.12
  Top Layer w0.254: 193.95,77.87 179.01,77.87 178.12,76.99 178.12,68.91 177.75,68.54 175.74,68.54 175.26,69.02 175.26,69.82 R12.2 ; 89.35,53.81 72.13,53.81 ; 89.35,53.81 89.35,65.96 ; 89.35,53.81 89.35,52.87 R17.2 ; 72.13,53.81 72.1,53.78 72.1,48.72 71.47,48.09 64.28,48.09 64.1,47.91 C16.2 63.24,45.84 63.24,45.28 63.65,45.28 63.97,44.96 63.97,44.95 65.13,43.79 66.05,43.79 ; 72.13,53.81 72.1,53.81 72.1,60.25 v1(72.26,60.41) ; 61.49,74.53 61.49,74.24 ; 61.49,74.53 62.35,75.39 TOUCH.6 ; 61.49,74.53 61.49,76.28 62.1,76.28 62.48,75.9 63.6,75.9 TOUCH.5 ; 61.49,74.24 61.49,72.86 61.54,72.8 61.54,71.26 61.72,71.08 62.87,71.08 64.03,69.91 64.03,69.68 ; 61.49,74.24 C38.2 ; 64.16,68.92 64.16,67.99 63.37,67.21 63.37,62.51 63.69,62.19 63.84,62.19 ; R15.2 165.73,65.9 165.67,65.96 ; v1(283.08,66.89) 284.23,66.89 R6.1 R5.1 ; R14.2 203.7,65.72 203.94,65.96 ; 127.32,65.96 127.25,65.89 R16.2 ; R4.1 282.49,73.9 280.74,73.9 R3.1 ; 64.03,69.05 64.03,69.68 ; 64.03,69.68 64.28,69.93 65.36,69.93 65.36,69.9 65.35,69.89 65.35,69.54 65.36,69.53 65.36,68.33 GYRO.3 ; 63.84,62.19 65.86,62.19 65.9,62.23 R18.2 65.9,63.32 66.28,63.7 GYRO.10 ; 63.84,62.19 63.84,61.73 64.52,61.06 v1(64.52,60.28)
  Top Layer w0.6: R10.2 204.35,78.57 204.47,78.57 ; 204.47,78.57 205.87,78.57 206.32,78.11 206.32,69.04 206.95,68.41 242.06,68.41 242.98,69.33 242.98,71.94 ; 204.47,78.57 204.11,78.93 204.11,81.94 203.73,82.32 194.33,82.32 190.71,78.7 165.74,78.7 164.72,77.68 163.23,77.68 163.01,77.9 ; 163.01,77.9 163.45,77.9 C19.2 163.37,77.82 ; 163.01,77.9 C21.2 C20.2 160.13,77.12 C14.1 159.26,75.78 158.75,75.27 156.81,75.27 U1.3 156.73,72.88 3_3_BRIGDE.2 3_3_BRIGDE.1 148.72,72.35 148.21,72.86 148.21,75.64 147.61,76.24 146.61,76.24 ; 146.43,76.41 146.52,76.33 ; 224.66,66.3 244.86,66.3 244.86,70.06 244.06,70.86 ; 224.66,66.3 204.28,66.3 203.94,65.96 89.35,65.96 ; 224.66,66.3 224.66,49.36 OLED.2 ; ESP32S3.2 306.32,79.83 TP6.1 v1(306.32,81.87) ; v1(280.42,71.71) 280.42,73.57 280.74,73.9 ; v1(248.41,70.86) 244.06,70.86 ; 244.06,70.86 242.98,71.94 ; CMIDI.2 192.47,76.9 193.23,76.9 193.95,77.62 193.95,80.45 ; 242.98,71.94 242.98,77.59 241.77,77.59 241.17,78.19 241.17,80.64 241.41,80.89 C8.2 243.59,80.89 C7.1 245.27,81.05 C13.1
  Top Layer w1: LDO.2 LDO.4 245.79,81.28 C13.1
  Bottom Layer w0.254: 282.96,73.36 283.08,73.24 v1(283.08,66.89) ; v1(72.26,60.41) 64.66,60.41 64.53,60.28 v1(64.52,60.28) ; v1(306.32,81.87) 306.45,81.75 307.59,81.75 307.85,81.49 307.85,63.96 307.85,63.95 307.85,61.43 304.42,58 DEBUG.4
  Bottom Layer w0.6: v1(306.32,81.87) 289.88,81.87 287.26,79.25 287.26,74.37 286.26,73.36 282.96,73.36 281.18,71.59 281.05,71.59 280.42,70.95 ; v1(248.41,70.86) 248.54,70.73 280.2,70.73 280.42,70.95 ; 280.42,70.95 v1(280.42,71.71)
+5V: length 1085.7
  Top Layer w0.254: v1(113.67,45.3) v1(113.67,48.22) ; v1(63.25,39.84) v1(63.25,42.5) 63.26,42.5 64.13,43.37 72.28,43.37 72.64,43.73 72.64,45.07 72.38,45.34 ; U2.8 66.11,45.35 72.38,45.35 ; v1(190.63,45.42) v1(190.63,48.47) ; v1(152.53,45.55) v1(152.53,48.47) ; 253.66,68.92 253.53,68.79
  Top Layer w0.4: 253.53,68.79 253.53,67.81 252.42,66.71 250.5,66.71 249.68,67.52 249.68,72.47 249.86,72.65 251.51,72.65 252.35,73.49 252.35,75.56 LDO.3 253.7,75.61 254.63,76.54 254.63,79.24 C12.1
  Top Layer w0.8: C45.2 L2.2 ; 252.87,70.73 255.72,70.73
  Top Layer w1: v2(263.4,39.58) v2(259.84,39.58) v2(259.84,41.47) 259.84,45.72 251.06,54.51 251.06,55.92 254.65,59.52 254.65,68.3 254.03,68.92 253.66,68.92 ; C45.2 253.42,70.04 C44.1
  Bottom Layer w0.254: 274.71,6.19 274.71,3.13 CLED21.2 272.58,1.35 ; 109.69,22.31 112.12,22.31 112.12,25.02 ; 109.69,22.31 CLED3.2 ; 109.69,22.31 109.69,20.79 ; CLED10.2 157.73,3.13 ; 157.73,3.13 159.97,3.13 159.97,5.97 ; 157.73,3.13 157.73,1.61 ; CLED20.2 253.41,3.13 ; 253.41,3.13 255.48,3.13 255.48,6.1 ; 253.41,3.13 253.41,1.35 ; 234.29,3.13 234.29,1.35 ; 234.29,3.13 CLED19.2 ; 234.29,3.13 236.38,3.13 236.38,6.1 ; 188.78,25.28 188.72,25.22 188.72,22.56 188.47,22.31 CLED12.2 186.65,20.79 ; 62.1,49.5 62.1,52.54 62.73,53.16 63,53.16 ; v1(190.63,48.47) 190.64,48.46 192.53,48.46 ; 291.63,39.58 CLED25.2 293.63,41.36 293.63,44.42 ; 66.09,49.49 65.96,49.36 62.24,49.36 ; 274.33,41.49 LED24.1 ; 274.33,41.49 282.55,41.49 282.55,39.58 ; 274.33,41.49 CLED24.2 ; 194.78,40.01 CLED26.2 194.65,45.42 v1(190.63,45.42) ; 90.67,22.31 93.02,22.31 93.02,25.02 ; 90.54,22.18 90.54,20.92 90.67,20.79 ; 215.15,1.35 CLED18.2 217.28,3.13 217.28,6.1 ; 73.92,25.02 73.92,22.31 CLED1.2 ; CLED4.2 128.73,22.31 ; 128.73,22.31 131.22,22.31 131.22,25.02 ; 128.73,22.31 128.73,20.79 ; v1(113.67,48.22) 115.7,48.22 LED28.1 ; 119.52,1.61 CLED8.2 121.77,3.13 121.77,5.97 ; 196.05,1.35 CLED17.2 198.18,3.13 198.18,6.1 ; 156.51,39.84 156.55,39.88 CLED27.2 156.17,45.55 v1(152.53,45.55) ; CLED15.2 244.05,22.31 ; 244.05,22.31 244.05,20.79 ; 244.05,22.31 246.08,22.31 246.08,25.28 ; 102.67,5.97 102.67,3.13 CLED7.2 100.42,1.35 ; 147.96,22.31 150.32,22.31 150.32,25.02 ; 147.96,22.31 CLED5.2 ; 147.96,22.31 147.96,21.04 ; 207.88,25.28 207.88,22.31 CLED13.2 205.75,21.04 ; 63,53.16 63.96,53.16 64.07,53.27 64.07,54.12 64.9,54.95 CLED31.2 ; 63,53.16 62.22,53.94 62.22,58.37 62.47,58.62 LED30.1 ; 169.68,25.28 169.68,22.31 CLED11.2 167.55,20.79 ; LED29.1 76.7,48.46 75.85,47.62 75.85,45.3 CLED29.2 79.97,39.93 79.88,39.84 ; v1(113.67,45.3) CLED28.2 118.2,39.95 118.32,39.84 ; 83.57,5.97 83.57,3.13 CLED6.2 ; 140.87,5.97 140.87,3.13 CLED9.2 138.62,1.61 ; 154.3,48.46 154.29,48.47 v1(152.53,48.47) ; 226.98,25.28 226.98,22.31 CLED14.2 224.85,20.79 ; 62.1,49.36 62.1,42.9 62.5,42.5 v1(63.25,42.5) ; 179.08,6.1 179.08,3.13 CLED16.2 176.95,1.35 ; 272.45,20.79 CLED23.2 274.58,22.31 274.58,25.12 ; LED22.1 293.88,3.01 CLED22.2 291.63,1.35
  Bottom Layer w1: 300.23,1.35 81.32,1.35 CLED6.2 ; v2(259.84,39.58) 195.21,39.58 194.95,39.84 63.5,39.84 63.37,39.96 ; CLED1.2 71.41,20.79 300.23,20.79 ; 300.23,20.79 308.23,20.79 309.12,21.67 309.12,38.95 292.26,38.95 291.63,39.58 v2(263.4,39.58) ; 300.23,20.79 300.23,1.48
AGND: length 60.9
  Top Layer w0.254: 61.72,80.6 61.72,77.91 61.37,77.55 ; C11.1 280.63,76.17 C9.2 ; 63.24,44.28 63.24,43.78 ; v1(65.48,64.29) 65.3,64.47 C35.2 65.3,66.48 GYRO.8 GYRO.9 ; 60.94,76.84 63.33,76.84 v1(63.45,76.72) ; 60.94,76.84 60.94,77.19 C41.2 ; 60.94,76.84 C40.2 60.07,76.28 ; TOUCH.7 64.77,74.89 TOUCH.17 ; ESP32S3.41 ESP32S3.41 ; ESP32S3.41 ESP32S3.41 ESP32S3.41 ; ESP32S3.41 298.48,72.58 298.48,71.18 ; ESP32S3.41 ESP32S3.41 ; C37.2 60.16,73.63 C38.1 C39.1 ; v1(64.77,69.05) 64.78,69.03 GYRO.4 ; C15.2 149.3,77.3 147.64,77.3 147.44,77.1 146.67,77.1 146.47,77.3 v1(146.18,77.3) ; C16.1 65.19,45.14 65.31,45.02 65.31,44.61 65.58,44.34 65.99,44.34 U2.6 ; C8.1 242.25,79.65 C7.2 244.37,79.02 C13.2 245.72,78.95 v1(247.68,78.95) ; ESP32S3.41 ESP32S3.41 ; ESP32S3.41 298.48,73.98 ; 290.96,78.44 290.96,78.57 291.08,78.7 290.77,78.7 290.67,78.79 290.36,78.79 290.2,78.95 ; C22.1 141.1,76.83 ; GYRO.1 v1(66.93,68.29)
  Top Layer w1: 58.55,8.59 62.87,8.59 ; A_D_BRIDGE.2 164.82,72.07 163.35,72.07 A_D_BRIDGE.1
  Bottom Layer w0.254: v1(146.18,77.3) 145.33,78.15 v1(142.76,78.15) 142.76,79.73 143.76,80.73 143.76,81.17 143.84,81.25 143.84,81.73 143.76,81.81 143.76,82
  Bottom Layer w1: 61.72,8.34 61.47,8.59 58.67,8.59
  vias: v1(7.24,41.36) v1(20.07,41.36) v1(25.78,74.13) v1(25.78,70.17) v1(25.78,68.54) v1(25.78,62.44) v1(25.78,16.72) v1(30.48,53.04) v1(37.47,79.59) v1(37.47,70.06) v1(37.47,68.41) v1(37.97,4.66) v1(44.32,26.63) v1(44.58,54.06) v1(44.83,39.96) v1(49.4,72.6) v1(50.8,69.17) v1(50.8,66.25) v1(52.58,59.14) v1(53.2,40.25) v1(55.12,13.29) v1(55.37,73.11) v1(57.35,53.04) v1(57.4,25.36) v1(61.72,82.25) v1(62.87,50.12) v1(63.12,54.69) v1(63.12,36.91) v1(64.64,74.63) v1(65.29,26.52) v1(65.79,13.29) v1(65.91,3.89) v1(66.25,46.69) v1(67.44,76.16) v1(67.82,66.89) v1(68.07,54.69) v1(68.33,78.44) v1(68.93,22.31) v1(69.22,63.33) v1(69.22,55.96) v1(69.98,50.76) v1(71.37,80.86) v1(72.39,70.19) v1(74.88,7.49) v1(78.87,69.93) v1(82.55,45.3) v1(84.38,26.52) v1(86.36,70.06) v1(88.14,22.31) v1(92.08,51.01) v1(93.82,7.47) v1(94.85,73.03) v1(97.79,3.13) v1(103.51,26.52) v1(106.93,22.31) v1(107.44,50.88) v1(107.82,73.4) v1(109.73,43.65) v1(113.29,7.48) v1(116.33,3.13) v1(120.52,43.94) v1(120.65,73.36) v1(122.77,26.57) v1(125.98,22.31) v1(127.64,73.62) v1(127.89,43.65) v1(132.25,7.49) v1(132.84,58.63) v1(132.84,51.01) v1(133.08,77.39) v1(135.5,3.13) v1(135.89,80.09) v1(140.84,71.08) v1(141.24,76.46) v1(141.48,75.14) v1(141.76,26.52) v1(144.15,71.84) v1(145.14,22.31) v1(145.8,58.63) v1(145.92,50.76) v1(147.45,43.77) v1(149.48,82.13) v1(151.26,7.48) v1(153.29,68.54) v1(154.75,3.13) v1(158.88,45.17) v1(161.29,26.75) v1(161.8,72.09) v1(164.9,22.31) v1(167.64,62.7) v1(171.07,50.76) v1(171.2,58.76) v1(171.7,77.39) v1(171.7,72.59) v1(174.04,3.13) v1(179.95,26.83) v1(183.13,58.38) v1(183.13,50.63) v1(183.95,22.31) v1(184.38,72.5) v1(188.85,50.63) v1(188.85,45.68) v1(188.98,29.55) v1(190.03,41.74) v1(190.37,27.77) v1(190.53,7.61) v1(191.9,73.62) v1(192.91,3.13) v1(196.52,41.3) v1(199.19,26.78) v1(200.41,78.06) v1(200.79,49.36) v1(200.91,46.95) v1(202.84,22.31) v1(203.71,72.73) v1(208.15,52.03) v1(209.3,42.12) v1(211.99,3.13) v1(213.11,47.84) v1(217.68,62.82) v1(217.68,55.2) v1(218.29,26.79) v1(221.87,74.63) v1(222.38,22.31) v1(224.41,72.73) v1(226.57,74.51) v1(230.45,55.2) v1(230.5,62.95) v1(230.89,3.13) v1(238,26.75) v1(241.12,22.31) v1(247.02,7.58) v1(249.98,3.13) v1(256.29,44.66) v1(257.43,31.04) v1(258.44,51.14) v1(259.14,65.49) v1(260.86,55.58) v1(261.75,69.17) v1(263.78,22.82) v1(265.81,65.49) v1(269.26,3.13) v1(269.65,22.31) v1(270.38,34.12) v1(270.51,15.32) v1(272.29,68.79) v1(275.59,64.35) v1(276.99,43.65) v1(279.15,76.03) v1(282.32,63.46) v1(285.24,7.58) v1(285.98,45.93) v1(286.26,77.17) v1(288.39,3.01) v1(288.42,59.14) v1(288.54,23.33) v1(288.92,41.74) v1(294,65.11) v1(294.39,77.17) v1(294.39,72.98) v1(298.7,66.63) v1(303.15,56.6) v1(304.42,23.07) v1(305.44,56.6) v1(306.32,63.71) v1(306.45,72.6) v1(307.27,63.71) v1(308.1,14.69) v1(310.13,60.28) v1(310.13,54.82) v1(310.13,41.36) v1(311.28,81.62)
VBUS: length 12.7
  Top Layer w0.6: USB.A4B9 268.72,75.51 v1(268.35,75.14) ; v1(264.67,75.14) 263.53,75.14 263.92,75.54 263.92,76.95
  Top Layer w1: FUSE.1 263.53,71.28 263.53,75.14
  Bottom Layer w0.6: v1(264.67,75.14) 264.67,75.14 v1(268.35,75.14)
(no net): length 0.1
  Top Layer w0.254: 196.6,80.2 196.53,80.13
CHIP_BOOT: length 17.3
  Top Layer w0.254: v1(283.46,59.01) 284.35,59.9 287.4,59.9 287.95,60.45 C10.2 290.59,62.82 ESP32S3.27
  Bottom Layer w0.254: v1(283.46,59.01) 283.46,52.66 KEY_25.1
CHIP_RESET: length 34.8
  Top Layer w0.254: ESP32S3.3 304.52,80.37 304.52,80.69 304.5,80.71 304.5,81.73 303.78,82.45 295.42,82.45 295.29,82.59 285.07,82.59 284.55,82.07 284.55,81.57 284.1,81.11 282.83,81.11 282.51,80.79 282.51,77.99 281.6,77.99 ; 281.6,77.99 281.61,77.98 281.61,74.76 ; 281.6,77.99 279.26,77.99
HEADPHONE_GROUND: length 9.2
  Top Layer w0.2: v1(140.08,78.95) 140.1,78.93 CODEC.2
  Bottom Layer w0.254: v1(140.08,78.95) 134.45,78.95 HEADPHONE.1
HEADPHONE_LEFT: length 17.9
  Top Layer w0.2: CODEC.4 140.84,78.13 140.84,77.81 140.51,77.48 139.96,77.48 139.57,77.09 139.57,74.83 138.62,73.87 128.91,73.87 128.1,74.68 HEADPHONE.5
HEADPHONE_RIGHT: length 7.3
  Top Layer w0.254: HEADPHONE.2 138.1,77.68 139.38,78.96 139.38,79.58 140.84,79.58 141.1,79.33 CODEC.1
I2C_SCL: length 271.4
  Top Layer w0.2: CODEC.19 142.74,80.98 v1(142.24,81.49)
  Top Layer w0.254: GYRO.12 67.18,67.64 67.56,68.03 67.56,71.25 v1(67.94,71.63) 68.71,72.4 68.71,74.13 67.44,75.39 TOUCH.15 ; v1(272.83,65.57) 273.21,65.95 282.29,65.95 283.84,64.4 284.88,64.4 285.59,65.11 285.87,65.11 ; v1(132.21,82.25) 133.48,82.25 v1(134.49,81.24) ; ESP32S3.25 286.12,65.36 286.25,65.49
  Bottom Layer w0.254: v1(67.94,71.63) 78.56,82.25 v1(132.21,82.25) ; v1(272.83,65.57) 272.59,65.57 271.02,64 260.82,64 252.79,55.97 250.19,55.97 240.58,46.35 223.22,46.35 222.88,46.69 OLED.3 221.71,47.42 219.11,47.42 205.53,61 159.85,61 159.6,61.26 159.6,65.57 149.36,75.8 142.72,75.8 140.93,77.59 140.93,80.18 141.99,81.24 ; 141.99,81.24 138.9,81.24 138.6,81.54 137.59,81.54 137.29,81.24 v1(134.49,81.24) ; 141.99,81.24 v1(142.24,81.49)
I2C_SDA: length 274.2
  Top Layer w0.2: v1(143.26,81.49) 143.14,81.38 CODEC.18
  Top Layer w0.254: GYRO.2 65.78,69.7 65.77,69.72 66.08,69.72 ; ESP32S3.24 286,66.63 285.87,66.76 285.87,67.23 285.37,67.73 282.91,67.73 281.56,66.38 v1(272.8,66.38) ; 66.08,69.72 66.89,69.72 v1(66.93,69.68) ; 66.08,69.72 67.06,70.7 67.06,71.57 68.28,72.8 68.28,73.89 67.28,74.89 TOUCH.14
  Bottom Layer w0.254: 143.06,81.49 142.88,81.49 142.82,81.43 142.82,81.25 142.48,80.9 142.29,80.9 141.36,79.97 141.36,77.95 143.09,76.22 149.54,76.22 160.04,65.72 160.04,61.43 205.7,61.43 218.53,48.6 OLED.4 222.12,50.38 229.36,50.38 229.62,50.12 229.62,47.33 230.17,46.78 240.4,46.78 250.01,56.39 252.61,56.39 260.64,64.42 270.84,64.42 v1(272.8,66.38) ; 143.06,81.49 v1(143.26,81.49) ; 143.06,81.49 142.48,82.07 133.05,82.07 132.47,81.49 128.65,81.49 128.55,81.59 89.41,81.59 89.32,81.49 78.74,81.49 v1(66.93,69.68)
I2S_BCLK: length 167
  Top Layer w0.2: CODEC.15 144.91,79.33 v1(145.29,79.71)
  Top Layer w0.254: ESP32S3.33 298.71,59.7 297.97,58.97 292.4,58.97 290.96,57.53 280.32,57.53 278.16,59.69 262.28,59.69 257.5,64.47 v1(256.67,64.47)
  Bottom Layer w0.254: v1(256.67,64.47) 256.41,64.73 256.05,64.73 255.76,65.02 162.86,65.02 149.15,78.74 148.04,78.74 147.62,79.16 146.42,79.16 145.87,79.71 v1(145.29,79.71)
I2S_DIN: length 166.6
  Top Layer w0.2: 143.54,79.94 143.54,80.33 144.53,81.31 v1(144.53,81.57)
  Top Layer w0.254: v1(256.67,66.25) 256.92,66.25 262.64,60.54 278.51,60.54 280.67,58.38 290.58,58.38 291.78,59.58 291.82,59.58 292.05,59.82 295.44,59.82 296.17,60.54 ESP32S3.31
  Bottom Layer w0.254: v1(256.67,66.25) 255.99,66.25 255.61,65.87 163.22,65.87 149.08,80.01 146.77,80.01 145.67,81.11 144.53,81.11 v1(144.53,81.57)
I2S_DOUT: length 166
  Top Layer w0.2: v1(144.78,80.48) 144.22,80.48 144.02,80.28 144.02,80.24 144.01,80.23
  Top Layer w0.254: v1(256.62,65.31) 257.26,65.31 262.46,60.11 278.34,60.11 280.49,57.95 290.79,57.95 292.23,59.39 296.8,59.39 297.44,60.03 ESP32S3.32
  Bottom Layer w0.254: v1(256.62,65.31) 256.48,65.45 163.04,65.45 148.9,79.59 146.59,79.59 145.7,80.48 v1(144.78,80.48)
I2S_MLCK: length 2.4
  Top Layer w0.254: ESP32S3.35 301.37,62.21 R7.1
I2S_WS: length 169.1
  Top Layer w0.2: CODEC.14 146.38,78.93 v1(146.81,78.5)
  Top Layer w0.254: ESP32S3.34 299.98,59.14 299.38,58.55 292.73,58.55 291.29,57.11 280.14,57.11 277.98,59.26 262.11,59.26 257.79,63.58 v1(256.67,63.58)
  Bottom Layer w0.254: v1(256.67,63.58) 256.73,63.52 256.73,63.39 255.53,64.6 162.69,64.6 149.22,78.06 147.98,78.06 147.3,78.74 147.05,78.74 v1(146.81,78.5)
LED_CTRL: length 250
  Top Layer w0.254: v1(256.67,67.14) 281.43,67.14 282.45,68.16 289.55,68.16 ESP32S3.23 ; v1(243.84,67.14) 204.28,67.14 203.7,66.56 71.68,66.56 71.68,48.9 71.3,48.51 62.78,48.51 62.51,48.24 62.51,45.11 62.84,44.78 63.24,44.78
  Bottom Layer w0.254: v1(243.84,67.14) v1(256.67,67.14)
LINE_IN_LEFT: length 6.6
  Top Layer w0.254: LINE-IN.5 102.74,75.31 C25.1 103.88,69.97 TP15.1
LINE_IN_RIGHT: length 6.7
  Top Layer w0.254: TP16.1 112.73,69.89 C26.1 112.78,75.31 LINE-IN.2
LINE_OUT_LEFT: length 6.2
  Top Layer w0.254: 115.4,75.31 115.41,75.3 C27.1 115.34,70.13 TP17.1
LINE_OUT_RIGHT: length 6.2
  Top Layer w0.254: C28.1 125.52,70.24 TP18.1 ; 125.4,75.31 125.4,70.26
MIC_EXTERNAL: length 25.6
  Top Layer w0.254: 74.73,77.74 74.73,73.81 75.06,73.49 87.12,73.49 89,75.37 90,75.37 ; 74.73,77.74 MIC_SELECT.4 ; 74.73,77.74 MIC_SELECT.6
MIC_IN: length 92.6
  Top Layer w0.254: MIC_SELECT.1 MIC_SELECT.2 69.48,79.94 MIC_SELECT.5 69.48,76.53 70.11,75.9 73.79,75.9 74.31,75.38 74.31,73.64 75.74,72.2 75.74,67.71 113.31,67.71 113.51,67.9 127.92,67.9 130.08,70.06 143.48,70.06 C29.1 143.59,69.95 144.78,69.95 R8.1
MIC_INTERNAL: length 9.4
  Top Layer w0.254: MIC_SELECT.3 79.69,81.94 80.01,81.62 80.01,77.79 MIC_INTERNAL.1
MIDI_IN: length 114.8
  Top Layer w0.254: v1(205.1,75.9) 205.1,76.04 R10.1 199.64,76.93 199.14,77.44 199.14,80.2 ; v1(285.62,81.24) 285.81,81.42 294.24,81.42 294.9,80.76 ESP32S3.11
  Bottom Layer w0.254: v1(285.62,81.24) 285.62,79.55 277.95,71.88 246.49,71.88 242.51,67.9 205.49,67.9 205.1,68.28 v1(205.1,75.9)
MIDI_OUT: length 114.1
  Top Layer w0.254: v1(203.71,67.39) 202.82,67.39 202.82,67.4 190.88,67.4 R13.2 ; v1(287.4,82) 287.56,82.16 295.11,82.16 296.17,81.11 ESP32S3.10
  Bottom Layer w0.254: v1(203.71,67.39) 242.95,67.39 247.02,71.46 278.13,71.46 287.4,80.73 v1(287.4,82)
POT_1: length 238.4
  Top Layer w0.254: ESP32S3.15 289.76,78.11 287.83,78.11 287.78,78.06 287.78,74.63 287.28,74.14 284.83,74.14 281.25,70.56 270.05,70.56 270.05,68.59 269.67,68.21 256.46,68.21 255.45,67.19 255.45,58.68 v1(252.09,55.33)
  Bottom Layer w0.254: POT_1.2 80.39,50.69 80.39,53.55 81.92,55.08 210.86,55.08 220,45.93 240.75,45.93 250.15,55.33 v1(252.09,55.33)
POT_2: length 220
  Top Layer w0.254: v1(297.18,77.68) 297.18,79.57 ESP32S3.9
  Bottom Layer w0.254: v1(297.18,77.68) 297.18,62.61 296.7,62.14 281.1,62.14 279.98,63.25 279.98,68.33 278.76,69.55 277.61,69.55 277.37,69.32 277.37,68.96 271.99,63.57 261.17,63.57 251.92,54.33 249.86,54.33 242.67,47.13 242.67,46.41 241.76,45.51 219.83,45.51 210.68,54.65 119.46,54.65 118.62,53.81 118.62,50.81 POT_2.2
POT_3: length 213.4
  Top Layer w0.254: v1(255.02,41.61) 255.97,41.61 261.8,35.78 264.28,35.78 265.38,34.68 265.38,31.63 268.72,28.29 279.29,28.29 279.78,28.79 279.78,39.96 280.67,40.85 304.67,40.85 306.33,42.51 ESP32S3.39
  Bottom Layer w0.254: POT_3.2 157.1,52.03 157.61,52.54 202.53,52.54 204,51.06 204,46.52 203.04,45.56 198.25,45.56 197.14,44.45 197.14,42.36 198.14,42.36 198.5,41.99 198.5,41.49 199.09,40.9 202.42,40.9 202.52,40.81 243.25,40.81 244.06,41.61 v1(255.02,41.61)
POT_4: length 190.4
  Top Layer w0.254: v1(254.51,40.6) 256.38,40.6 261.63,35.36 264.11,35.36 264.95,34.51 264.95,31.46 267.84,28.57 267.84,24.21 268.35,23.71 275.18,23.71 275.9,24.43 275.9,27.61 276.16,27.87 279.46,27.87 280.2,28.61 280.2,39.79 280.85,40.43 304.85,40.43 306.75,42.33 306.75,60.04 307.33,60.61 308.43,60.61 308.61,60.79 308.61,63.46 307.59,64.47 306.07,64.47 305.06,63.46 ESP32S3.38
  Bottom Layer w0.254: v1(254.51,40.6) 254.3,40.38 199.41,40.38 199.32,40.48 198.91,40.48 198.08,41.31 198.08,41.72 197.87,41.93 196.93,41.93 196.72,42.14 196.72,44.66 198.04,45.98 202.87,45.98 203.58,46.69 203.58,50.88 202.35,52.11 196.75,52.11 POT_4.2
TOUCH_COL_1: length 361.1
  Top Layer w0.254: v1(279.4,67.72) 281.42,67.72 282.32,68.63 289.27,68.63 ESP32S3.22 ; v1(165.48,8.8) 167.72,8.8 v1(167.77,8.85) ; v1(199.01,44.53) v1(192.53,44.53) ; v1(249.56,51.27) 249.56,50.06 253.54,46.07 253.54,26.39 264.17,15.76 264.66,15.76 265.23,16.33 270.66,16.33 274.18,12.82 274.18,11.15 v1(275.46,9.86) ; v1(84.33,10.5) 84.33,14.82 80.39,14.82 80.39,28.02 v1(77.22,28.02) ; v1(180.47,10.37) 180.47,13.93 179.58,14.82 176.91,14.82 176.15,15.58 176.15,27.26 175.51,27.9 v1(172.85,27.9) 170.94,29.8 170.94,34.95 171.22,35.23 171.22,36.82 170.94,37.1 v1(170.94,44.53)
  Bottom Layer w0.254: v1(170.94,44.53) v1(172.34,44.53) v1(192.53,44.53) ; v1(275.46,9.86) 276.07,10.47 KEY_D21.1 ; KEY_D1.1 v1(77.22,28.02) ; v1(84.33,10.5) 86.74,10.5 86.74,10.6 97.34,10.6 99.19,8.75 165.06,8.75 165.1,8.8 v1(165.48,8.8) ; KEY_D16.1 182.15,10.37 v1(180.47,10.37) 178.97,8.88 167.8,8.88 v1(167.77,8.85) ; v1(279.4,67.72) 279.4,63.33 278.21,62.14 262.27,62.14 252.39,52.26 250.55,52.26 v1(249.56,51.27) 249.56,50.55 244.22,45.22 244.22,44.86 243.39,44.03 199.52,44.03 v1(199.01,44.53) ; KEY_D11.1 v1(172.85,27.9)
TOUCH_COL_2: length 359.1
  Top Layer w0.254: v1(181.1,11.51) 181.1,9.5 180.85,9.24 169.02,9.24 168.4,9.86 v1(165.48,9.86) ; ESP32S3.21 283.53,70.44 281.4,68.31 279.16,68.31 279.13,68.28 v1(278.76,68.28) ; v1(96.39,28.02) 99.57,28.02 99.57,14.82 103.5,14.82 v1(103.5,10.5) ; v1(199.64,10.5) 199.64,13.93 198.88,14.69 196.22,14.69 195.39,15.51 195.39,27.07 194.56,27.9 v1(192.02,27.9) 192.02,35.59 v1(201.04,44.61) ; v1(293.88,10.12) 293.01,10.12 292,9.11 270.73,9.11 269.73,10.12 268.1,10.12 254,24.21 254,25.33 253.12,26.21 253.12,45.42 v1(248.35,50.19)
  Bottom Layer w0.254: v1(201.04,44.61) 201.2,44.45 243.21,44.45 243.71,44.95 243.71,46.58 247.85,50.72 ; KEY_D22.1 294.1,10.34 v1(293.88,10.12) ; v1(199.64,10.5) 199.67,10.47 KEY_D17.1 199.98,9.1 198.5,9.1 198.36,9.24 194.2,9.24 192.2,11.25 181.37,11.25 v1(181.1,11.51) ; v1(96.39,28.02) 96.39,29.77 KEY_D2.1 ; v1(103.5,10.5) 105.84,10.5 105.84,10.6 107.26,9.17 164.79,9.17 v1(165.48,9.86) ; v1(192.02,27.9) 192.02,29.57 KEY_D12.1 ; v1(278.76,68.28) 278.76,63.3 278.03,62.56 262.09,62.56 252.21,52.68 249.81,52.68 247.85,50.72 ; v1(248.35,50.19) 247.85,50.69 247.85,50.72
TOUCH_COL_3: length 332.7
  Top Layer w0.254: v1(250.38,53.74) 250.38,49.83 253.97,46.25 253.97,44.22 261.98,36.2 269.97,36.2 274.31,31.87 274.31,31.21 v1(276.1,29.42) ; v1(115.42,28.02) 118.75,28.02 118.75,14.82 122.68,14.82 v1(122.68,10.5) 122.56,10.37 122.56,1.57 123.28,0.85 217.62,0.85 218.69,1.92 v1(218.69,10.5) 218.69,14.05 218.06,14.69 215.65,14.69 214.5,15.83 214.5,27.39 213.87,28.02 v1(210.95,28.02) 208.03,30.95 208.03,33.84 209.42,35.23 209.42,36.82 208.03,38.22 v1(208.03,47.58) ; ESP32S3.20 289.55,71.46 283.95,71.46 281.41,68.92 v1(278.13,68.92)
  Bottom Layer w0.254: 124.94,10.6 124.94,10.5 v1(122.68,10.5) ; v1(210.95,28.02) 211.05,28.12 KEY_D13.1 ; KEY_D23.1 276.32,29.65 v1(276.1,29.42) ; KEY_D18.1 220.42,10.5 v1(218.69,10.5) ; v1(278.13,68.92) 278.13,63.26 277.85,62.98 261.92,62.98 252.46,53.53 250.6,53.53 v1(250.38,53.74) 249.87,53.74 243.09,46.96 243.09,45.05 242.91,44.87 210.73,44.87 v1(208.03,47.58) ; KEY_D3.1 v1(115.42,28.02)
TOUCH_COL_4: length 285.2
  Top Layer w0.254: v1(256.03,61.43) 255.97,61.36 255.97,57.68 v1(258.83,54.82) ; v1(141.6,10.5) 141.6,14.69 138.05,14.69 138.05,28.02 v1(134.62,28.02) ; v1(238.01,10.51) 238,10.52 238,13.67 237.11,14.56 234.44,14.56 233.43,15.58 233.43,27.64 232.79,28.28 232.54,28.28 v1(231.27,29.55) 233.43,31.71 v1(233.43,47.84) ; v1(276.73,69.43) 276.81,69.5 281.4,69.5 284.88,72.98 ESP32S3.19
  Bottom Layer w0.254: v1(233.43,47.84) 234.06,47.2 240.22,47.2 254.48,61.46 257.08,61.46 262.58,66.96 274.78,66.96 276.73,68.92 v1(276.73,69.43) ; v1(141.6,10.5) 144.04,10.5 144.04,10.6 ; KEY_D19.1 239.5,10.51 v1(238.01,10.51) ; KEY_D24.1 273.3,53.15 273.27,53.15 272.14,54.28 272.14,54.31 271.62,54.82 266.59,54.82 265.69,53.93 265.69,51.14 264.75,50.2 264.75,49.88 264.41,49.54 263.92,49.54 258.83,54.64 v1(258.83,54.82) ; v1(231.27,29.55) 230.24,29.55 KEY_D14.1 230.02,29.77 228.8,29.77 225.1,33.47 223,33.47 221.52,31.99 221.52,31.2 221.17,30.85 208.62,30.85 206,33.47 203.9,33.47 202.42,31.99 202.42,31.2 202.07,30.85 189.52,30.85 186.9,33.47 184.8,33.47 183.32,31.99 183.32,31.2 182.97,30.85 170.42,30.85 167.8,33.47 165.7,33.47 162.78,30.55 153.13,30.55 150.99,28.42 146.47,28.42 145.12,29.77 KEY_D4.1 134.52,28.02 v1(134.62,28.02)
TOUCH_COL_5: length 239.6
  Top Layer w0.254: ESP32S3.18 289.27,73.71 285,73.71 281.36,70.07 275.68,70.07 v1(275.59,69.98) ; v1(234.19,28.41) 234.19,40.6 240.03,46.44 v1(240.03,47.84) ; v1(153.67,28.02) 157.1,28.02 157.1,14.69 160.66,14.69 v1(160.66,10.62) ; v1(256.29,10.5) 256.29,13.67 255.14,14.82 253.24,14.82 252.22,15.83 252.22,17.86 252.35,17.99 v1(252.35,25.36)
  Bottom Layer w0.254: v1(252.35,25.36) 249.25,28.46 KEY_D15.1 249.12,29.77 245.55,29.77 244.2,28.42 223,28.42 221,30.42 210.56,30.42 208.55,28.42 203.9,28.42 201.9,30.42 191.46,30.42 189.45,28.42 184.8,28.42 182.8,30.42 172.36,30.42 170.35,28.42 165.7,28.42 164.35,29.77 KEY_D5.1 153.62,28.02 v1(153.67,28.02) ; 163.14,10.6 163.1,10.6 163.07,10.62 v1(160.66,10.62) ; v1(240.03,47.84) 254.2,62.01 257.03,62.01 262.41,67.39 274.6,67.39 275.59,68.37 v1(275.59,69.98) ; KEY_D20.1 258.62,10.5 v1(256.29,10.5)
TOUCH_ROW_1: length 302.9
  Top Layer w0.254: v1(139.32,41.23) 139.32,37.17 v1(140.84,35.64) ; ESP32S3.4 303.78,79.82 v1(303.78,77.55) ; v1(155.32,43.04) 157.96,43.04 v1(157.99,43.01) ; v1(194.06,43.01) 194.18,43.14 v1(197.73,43.14)
  Bottom Layer w0.254: 121.19,38.82 KEY_4.1 ; 121.19,38.82 139.57,38.82 139.57,34.2 KEY_5.1 140.84,34.04 v1(140.84,35.64) ; 121.19,38.82 102.09,38.82 ; v1(303.78,77.55) 303.78,61.04 303.15,60.41 262.94,60.41 245.7,43.17 197.76,43.17 v1(197.73,43.14) ; v1(155.32,43.04) 153.52,41.23 v1(139.32,41.23) ; v1(157.99,43.01) v1(194.06,43.01) ; 82.99,38.82 63.89,38.82 63.89,38.69 ; 82.99,38.82 102.09,38.82 ; 82.99,38.82 KEY_2.1 ; 63.89,38.69 KEY_1.1 ; 63.89,38.69 63.76,38.82 ; 102.09,38.82 KEY_3.1
TOUCH_ROW_2: length 305
  Top Layer w0.254: v1(198.28,43.82) v1(193.55,43.82) ; v1(155.57,41.49) 153.09,39 153.09,17.41 152.4,16.72 v1(149.1,16.72) ; v1(302.64,77.55) 302.64,79.71 ESP32S3.5 ; v1(157.99,43.82) 156,43.82 v1(155.96,43.77)
  Bottom Layer w0.254: v1(155.96,43.77) 156.08,43.77 156.11,43.74 156.11,42.02 v1(155.57,41.49) ; KEY_10.1 149.1,14.9 v1(149.1,16.72) 149.1,18.88 148.84,19.13 130.59,19.13 ; 111.48,19.13 92.39,19.13 ; 111.48,19.13 KEY_8.1 ; 111.48,19.13 130.59,19.13 ; 92.39,19.13 73.43,19.13 73.28,18.99 KEY_6.1 ; 92.39,19.13 KEY_7.1 ; 130.59,19.13 KEY_9.1 ; v1(157.99,43.82) 158.21,43.59 193.25,43.59 193.48,43.82 v1(193.55,43.82) ; v1(198.28,43.82) 198.51,43.59 245.52,43.59 262.79,60.86 302.46,60.86 302.64,61.04 v1(302.64,77.55)
TOUCH_ROW_3: length 208
  Top Layer w0.254: v1(245.95,44.97) 248.03,42.88 248.03,39.84 247.78,39.58 235.71,39.58 235.08,38.95 v1(235.08,35.39) ; ESP32S3.6 301.37,79.71 v1(301.37,77.55)
  Bottom Layer w0.254: v1(301.37,77.55) 301.37,61.81 300.85,61.29 262.62,61.29 249.67,48.34 249.32,48.34 v1(245.95,44.97) ; 178.49,38.62 KEY_12.1 ; 178.49,38.62 178.49,38.82 159.39,38.82 KEY_11.1 ; 178.49,38.62 197.59,38.62 ; 197.59,38.62 KEY_13.1 ; 197.59,38.62 216.69,38.62 ; 216.69,38.62 235.79,38.62 KEY_15.1 235.08,34.2 v1(235.08,35.39) ; 216.69,38.62 KEY_14.1
TOUCH_ROW_4: length 216.1
  Top Layer w0.254: v1(300.1,77.55) 300.1,79.71 ESP32S3.7 ; v1(247.44,47.53) 247.44,45.18 250.95,41.67 250.95,19.39 250.49,18.93 244.45,18.93 243.97,18.45 v1(243.97,16.72)
  Bottom Layer w0.254: 226.06,19.01 226.06,14.31 KEY_19.1 ; 226.06,19.01 244.86,19.01 244.86,15.83 ; 226.06,19.01 206.99,19.01 ; 206.99,19.01 KEY_18.1 ; 206.99,19.01 187.89,19.01 ; 187.89,19.01 KEY_17.1 ; 187.89,19.01 168.79,19.01 KEY_16.1 ; v1(243.97,16.72) 244.86,15.83 ; 244.86,15.83 245.19,15.5 KEY_20.1 ; v1(247.44,47.53) 247.91,47.53 249.15,48.77 249.5,48.77 262.44,61.71 299.59,61.71 300.1,62.22 v1(300.1,77.55)
TOUCH_ROW_5: length 139.4
  Top Layer w0.254: v1(264.17,50.12) 264.17,43.13 266.19,41.11 266.19,39.45 264.16,37.42 v1(264.16,36.79) ; v1(264.41,16.34) 264.41,18.75 ; 264.41,18.75 264.41,20.66 266.78,23.02 266.78,25.51 264.16,28.12 v1(264.16,30.82) ; 264.41,18.75 273.37,18.75 273.39,18.78 274.99,18.78 275.01,18.75 283.21,18.75 283.72,18.25 v1(283.72,16.21) ; ESP32S3.8 298.7,79.82 v1(298.7,77.55)
  Bottom Layer w0.254: v1(298.7,77.55) 299.29,78.14 304.37,78.14 304.93,77.58 v1(304.93,77.55) 304.93,61.59 303.32,59.99 264.88,59.99 264.03,59.14 264.03,52.67 KEY_24.1 v1(264.17,50.12) ; KEY_21.1 264.41,14.43 v1(264.41,16.34) ; KEY_22.1 283.72,14.3 v1(283.72,16.21) ; v1(264.16,36.79) 264.16,33.62 KEY_23.1 264.42,31.08 v1(264.16,30.82)
